# EAGLE schematic Sch (EAGLE 7.5.0)
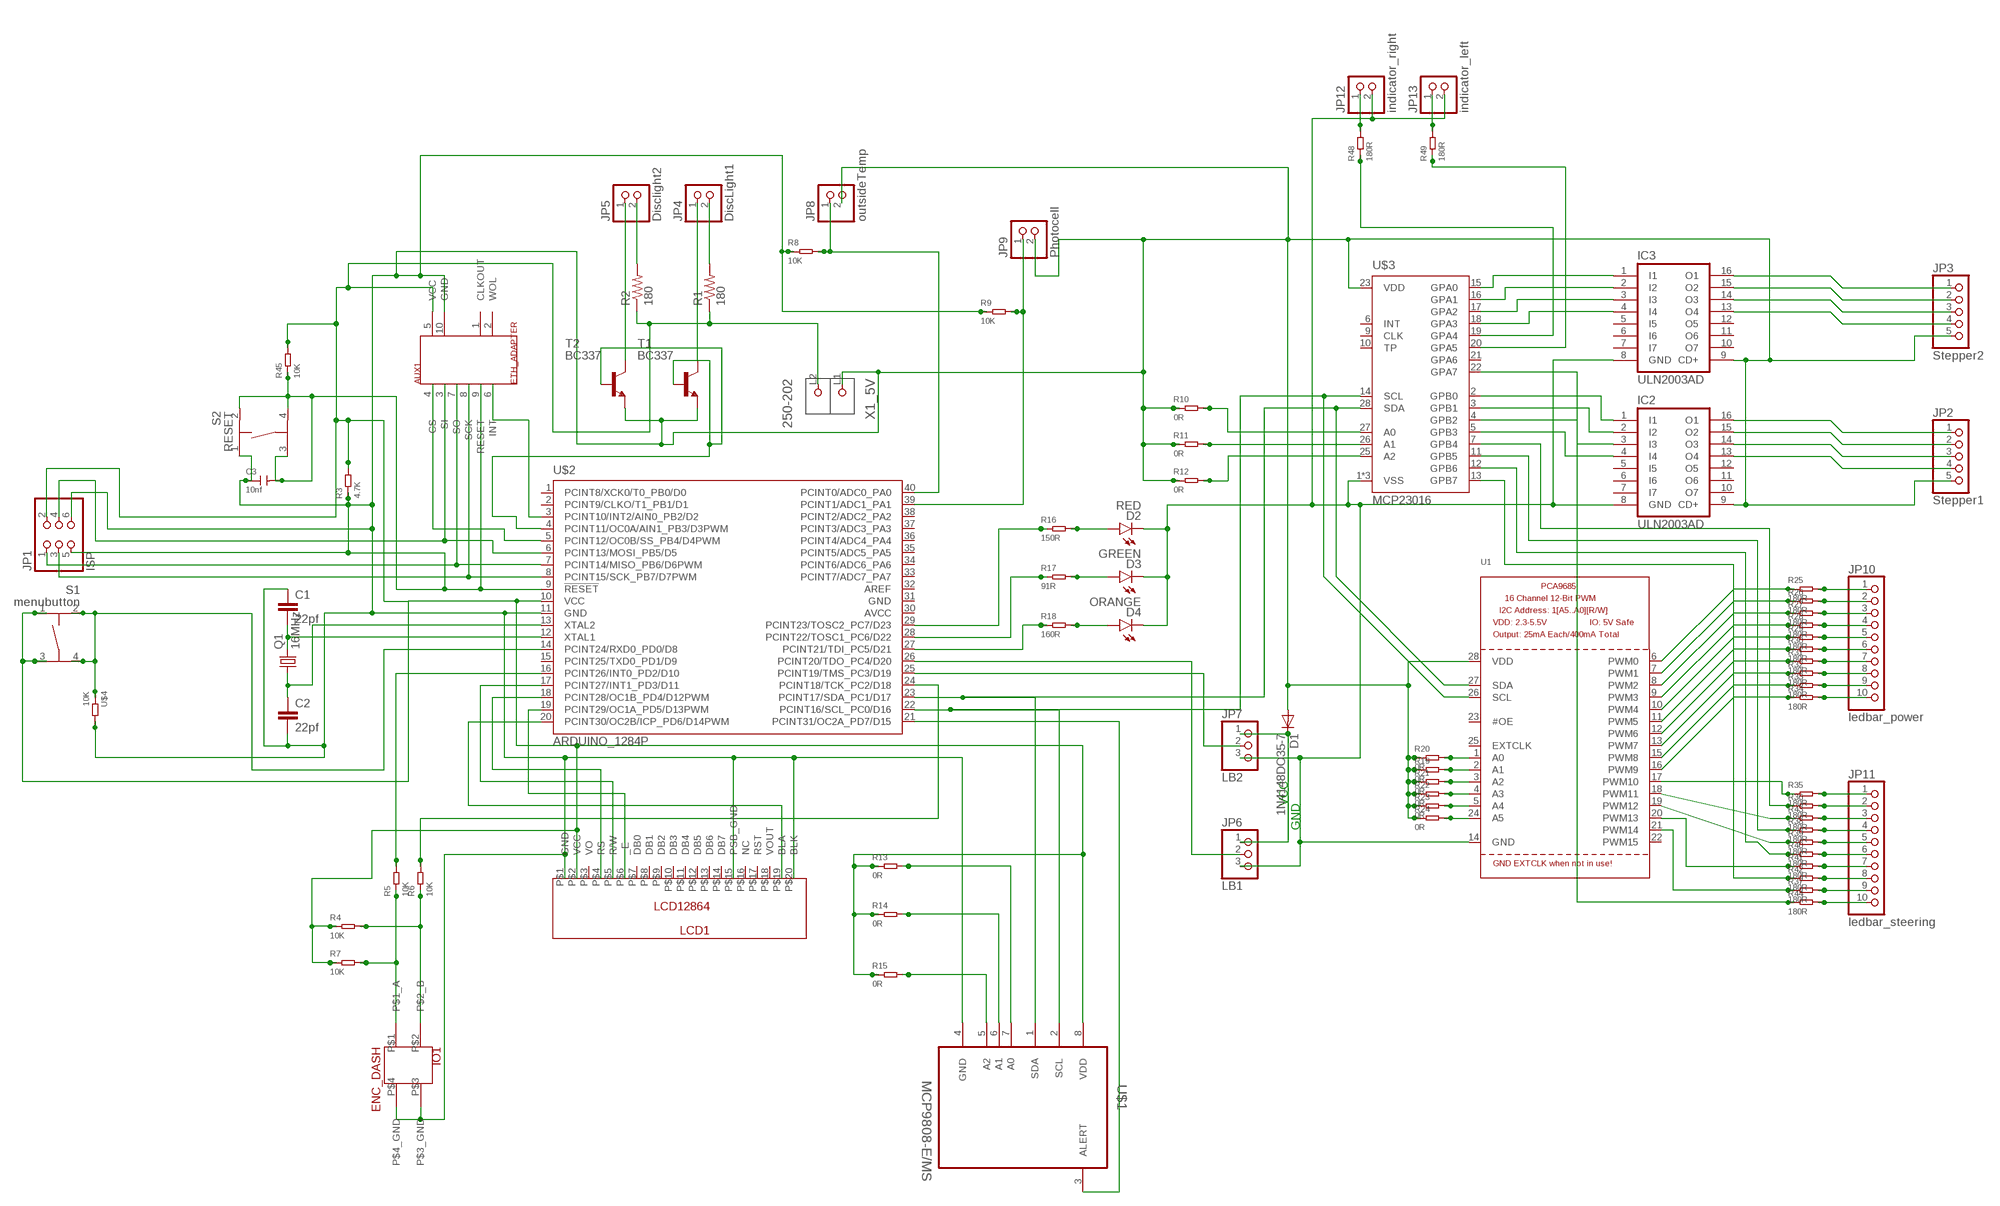
[diagram p0: schematic, sheet 1]

## Parts
AUX1  ETH_ADAPTER  [PINHEAD5X5]
C1  22pf  C-EU025-025X050  [C025-025X050]
C2  22pf  C-EU025-025X050  [C025-025X050]
C3  10nf  CERAMIC-10NF-50V-10%-X7R(0603)  [C0603]
D1  1N4148DO35-7  [DO35-7]
D2  RED  LED-RED0603  [LED-0603]
D3  GREEN  LED-RED0603  [LED-0603]
D4  ORANGE  LED-RED0603  [LED-0603]
IC2  ULN2003AD  [SO16]
IC3  ULN2003AD  [SO16]
IO1  ENC_DASH  [PINHEAD2X2]
JP1  ISP  PINHD-2X3  [2X03]
JP2  Stepper1  PINHD-1X5  [1X05]
JP3  Stepper2  PINHD-1X5  [1X05]
JP4  DiscLight1  PINHD-1X2  [1X02]
JP5  Disclight2  PINHD-1X2  [1X02]
JP6  LB1  PINHD-1X3  [1X03]
JP7  LB2  PINHD-1X3  [1X03]
JP8  outsideTemp  PINHD-1X2  [1X02]
JP9  Photocell  PINHD-1X2  [1X02]
JP10  ledbar_power  PINHD-1X10  [1X10]
JP11  ledbar_steering  PINHD-1X10  [1X10]
JP12  indicator_right  PINHD-1X2  [1X02]
JP13  indicator_left  PINHD-1X2  [1X02]
LCD1  LCD12864  [PINHEAD1X20]
Q1  16MHz  CRYSTALHC49S  [HC49/S]
R1  180  FLIPFLOP-RES  [0805-THM]
R2  180  FLIPFLOP-RES  [0805-THM]
R3  4.7K  SMD-RES-4.7K-5%-1/10W(0603)  [R0603]
R4  10K  SMD-RES-10K-1%-1/10W(0603)  [R0603]
R5  10K  SMD-RES-10K-1%-1/10W(0603)  [R0603]
R6  10K  SMD-RES-10K-1%-1/10W(0603)  [R0603]
R7  10K  SMD-RES-10K-1%-1/10W(0603)  [R0603]
R8  10K  SMD-RES-10K-1%-1/10W(0603)  [R0603]
R9  10K  SMD-RES-10K-1%-1/10W(0603)  [R0603]
R10  0R  SMD-RES-0R-5%-1/10W(0603)  [R0603]
R11  0R  SMD-RES-0R-5%-1/10W(0603)  [R0603]
R12  0R  SMD-RES-0R-5%-1/10W(0603)  [R0603]
R13  0R  SMD-RES-0R-5%-1/10W(0603)  [R0603]
R14  0R  SMD-RES-0R-5%-1/10W(0603)  [R0603]
R15  0R  SMD-RES-0R-5%-1/10W(0603)  [R0603]
R16  150R  SMD-RES-0R-5%-1/10W(0603)  [R0603]
R17  91R  SMD-RES-0R-5%-1/10W(0603)  [R0603]
R18  160R  SMD-RES-0R-5%-1/10W(0603)  [R0603]
R19  0R  SMD-RES-0R-5%-1/10W(0603)  [R0603]
R20  0R  SMD-RES-0R-5%-1/10W(0603)  [R0603]
R21  0R  SMD-RES-0R-5%-1/10W(0603)  [R0603]
R22  0R  SMD-RES-0R-5%-1/10W(0603)  [R0603]
R23  0R  SMD-RES-0R-5%-1/10W(0603)  [R0603]
R24  0R  SMD-RES-0R-5%-1/10W(0603)  [R0603]
R25  180R  SMD-RES-0R-5%-1/10W(0603)  [R0603]
R26  180R  SMD-RES-0R-5%-1/10W(0603)  [R0603]
R27  180R  SMD-RES-0R-5%-1/10W(0603)  [R0603]
R28  180R  SMD-RES-0R-5%-1/10W(0603)  [R0603]
R29  180R  SMD-RES-0R-5%-1/10W(0603)  [R0603]
R30  180R  SMD-RES-0R-5%-1/10W(0603)  [R0603]
R31  180R  SMD-RES-0R-5%-1/10W(0603)  [R0603]
R32  180R  SMD-RES-0R-5%-1/10W(0603)  [R0603]
R33  180R  SMD-RES-0R-5%-1/10W(0603)  [R0603]
R34  180R  SMD-RES-0R-5%-1/10W(0603)  [R0603]
R35  180R  SMD-RES-0R-5%-1/10W(0603)  [R0603]
R36  180R  SMD-RES-0R-5%-1/10W(0603)  [R0603]
R37  180R  SMD-RES-0R-5%-1/10W(0603)  [R0603]
R38  180R  SMD-RES-0R-5%-1/10W(0603)  [R0603]
R39  180R  SMD-RES-0R-5%-1/10W(0603)  [R0603]
R40  180R  SMD-RES-0R-5%-1/10W(0603)  [R0603]
R41  180R  SMD-RES-0R-5%-1/10W(0603)  [R0603]
R42  180R  SMD-RES-0R-5%-1/10W(0603)  [R0603]
R43  180R  SMD-RES-0R-5%-1/10W(0603)  [R0603]
R44  180R  SMD-RES-0R-5%-1/10W(0603)  [R0603]
R45  10K  SMD-RES-10K-1%-1/10W(0603)  [R0603]
R48  180R  SMD-RES-100R-5%-1/10W(0603)  [R0603]
R49  180R  SMD-RES-100R-5%-1/10W(0603)  [R0603]
S1  menubutton  TASTER-9314_SMD  [TASTER-9314_SMD]
S2  RESET  TASTER-9314_SMD  [TASTER-9314_SMD]
T1  BC337  [TO92]
T2  BC337  [TO92]
U1  PCA9685  [TSSOP28]
U$1  MCP9808-E/MS  [SOP65P490X110-8N]
U$2  ARDUINO_1284P  [DIL40]
U$3  MCP23016  [SO28W]
U$4  10K  SMD-RES-10K-1%-1/8W(0805)  [R0805]
X1_5V  250-202  [P-250-202]

## Nets
DISCLIGHT1: T1.2(B) T2.2(B) U$2.4(PCINT11/OC0A/AIN1_PB3/D3PWM)
GND: C1.1 C2.2 C3.1 D1.A IC2.9(CD+) IC3.9(CD+) JP1.6 JP2.5 JP3.5 JP8.2 JP9.2 LCD1.P$1(GND) LCD1.P$15(PSB_GND) LCD1.P$20(BLK) R3.1 R8.1 R9.1 R10.1 R11.1 R12.1 R19.1 R20.1 R21.1 R22.1 R23.1 R24.1 S2.1 T1.1(E) T2.1(E) U1.28(VDD) U$1.4(GND) U$2.11(GND) U$3.23(VDD) U$4.2 X1_5V.L1(P1)
N$1: IC2.16(O1) JP2.1
N$2: IC2.15(O2) JP2.2
N$3: IC2.14(O3) JP2.3
N$4: IC2.13(O4) JP2.4
N$5: IC3.16(O1) JP3.1
N$6: IC3.15(O2) JP3.2
N$7: IC3.14(O3) JP3.3
N$8: IC3.13(O4) JP3.4
N$9: JP1.2 LCD1.P$2(VCC) R1.1 R2.1 R3.2 R4.1 R7.1 R13.1 R14.1 R15.1 R45.2 S1.1 S1.3 U$1.8(VDD) U$2.10(VCC) X1_5V.L2(P2)
N$10: R36.1 U$3.7(GPB4)
N$11: JP5.1 T2.3(C)
N$12: JP5.2 R2.2
N$13: JP4.2 R1.2
N$14: JP4.1 T1.3(C)
N$15: S1.2 S1.4 U$2.14(PCINT24/RXD0_PD0/D8) U$4.1
N$16: IC3.1(I1) U$3.15(GPA0)
N$17: C2.1 Q1.1 U$2.13(XTAL2)
N$18: IC3.2(I2) U$3.16(GPA1)
N$19: C1.2 Q1.2 U$2.12(XTAL1)
N$20: IC3.3(I3) U$3.17(GPA2)
N$21: D1.C JP6.1 JP7.1
N$22: R11.2 U$3.26(A1)
N$23: AUX1.7(SO) JP1.1 U$2.7(PCINT14/MISO_PB6/D6PWM)
N$24: AUX1.8(SCK) JP1.3 U$2.8(PCINT15/SCK_PB7/D7PWM)
N$25: IC3.4(I4) U$3.18(GPA3)
N$26: AUX1.3(SI) JP1.4 U$2.6(PCINT13/MOSI_PB5/D5)
N$27: R38.1 U$3.11(GPB5)
N$28: U$1.3(ALERT) U$2.21(PCINT31/OC2A_PD7/D15)
N$29: R4.2 R6.1
N$30: AUX1.6(INT) U$2.3(PCINT10/INT2/AIN0_PB2/D2)
N$31: AUX1.4(CS) U$2.5(PCINT12/OC0B/SS_PB4/D4PWM)
N$32: U1.26(SCL) U$1.2(SCL) U$2.22(PCINT16/SCL_PC0/D16) U$3.14(SCL)
N$33: U1.27(SDA) U$1.1(SDA) U$2.23(PCINT17/SDA_PC1/D17) U$3.28(SDA)
N$34: R5.1 R7.2
N$35: IC2.1(I1) U$3.2(GPB0)
N$36: IC2.2(I2) U$3.3(GPB1)
N$37: LCD1.P$4(RS) U$2.18(PCINT28/OC1B_PD4/D12PWM)
N$38: LCD1.P$5(R/W) U$2.17(PCINT27/INT1_PD3/D11)
N$39: LCD1.P$6(_E) U$2.19(PCINT29/OC1A_PD5/D13PWM)
N$40: LCD1.P$19(BLA) U$2.20(PCINT30/OC2B/ICP_PD6/D14PWM)
N$41: R5.2 U$2.16(PCINT26/INT0_PD2/D10)
N$42: R6.2 U$2.24(PCINT18/TCK_PC2/D18)
N$43: IC2.3(I3) U$3.4(GPB2)
N$44: IC2.4(I4) U$3.5(GPB3)
N$45: R14.2 U$1.6(A1)
N$46: JP7.2 U$2.25(PCINT19/TMS_PC3/D19)
N$47: JP6.2 U$2.26(PCINT20/TDO_PC4/D20)
N$48: JP8.1 R8.2 U$2.40(PCINT0/ADC0_PA0)
N$49: R10.2 U$3.27(A0)
N$50: JP9.1 R9.2 U$2.39(PCINT1/ADC1_PA1)
N$51: R41.1 U1.20(PWM13)
N$52: R12.2 U$3.25(A2)
N$53: R13.2 U$1.7(A0)
N$54: R15.2 U$1.5(A2)
N$55: R39.1 U1.19(PWM12)
N$56: D2.A R16.2
N$57: D3.A R17.2
N$58: D4.A R18.2
N$59: R18.1 U$2.27(PCINT21/TDI_PC5/D21)
N$60: R17.1 U$2.28(PCINT22/TOSC1_PC6/D22)
N$61: R16.1 U$2.29(PCINT23/TOSC2_PC7/D23)
N$62: R24.2 U1.24(A5)
N$63: R23.2 U1.5(A4)
N$64: R22.2 U1.4(A3)
N$65: R21.2 U1.3(A2)
N$66: R19.2 U1.2(A1)
N$67: R20.2 U1.1(A0)
N$68: JP10.1 R25.2
N$69: JP10.2 R26.2
N$70: JP10.3 R27.2
N$71: JP10.4 R28.2
N$72: JP10.5 R29.2
N$73: JP10.6 R30.2
N$74: JP10.7 R31.2
N$75: JP10.8 R32.2
N$76: JP10.9 R33.2
N$77: JP10.10 R34.2
N$78: JP11.1 R35.2
N$79: JP11.2 R36.2
N$80: JP11.3 R43.2
N$81: JP11.4 R38.2
N$82: JP11.5 R39.2
N$83: JP11.6 R40.2
N$84: JP11.7 R41.2
N$85: JP11.8 R42.2
N$86: JP11.9 R37.2
N$87: JP11.10 R44.2
N$88: R25.1 U1.6(PWM0)
N$89: R26.1 U1.7(PWM1)
N$90: R27.1 U1.8(PWM2)
N$91: R28.1 U1.9(PWM3)
N$92: R29.1 U1.10(PWM4)
N$93: R30.1 U1.11(PWM5)
N$94: R31.1 U1.12(PWM6)
N$95: R32.1 U1.13(PWM7)
N$96: R33.1 U1.15(PWM8)
N$97: R34.1 U1.16(PWM9)
N$98: R35.1 U1.17(PWM10)
N$99: R43.1 U1.18(PWM11)
N$102: R37.1 U1.21(PWM14)
N$103: R40.1 U$3.12(GPB6)
N$105: AUX1.9(RESET) C3.2 JP1.5 R45.1 S2.2 S2.3 S2.4 U$2.9(!RESET)
N$106: R42.1 U$3.13(GPB7)
N$107: R44.1 U$3.22(GPA7)
N$108: R48.1 U$3.19(GPA4)
N$109: R49.1 U$3.20(GPA5)
N$110: JP12.1 R48.2
N$111: JP13.1 R49.2
N$112: D2.C D3.C D4.C IC2.8(GND) IC3.8(GND) JP6.3 JP7.3 JP12.2 JP13.2 U1.14(GND) U$3.1(VSS) U$3.8(VSS) U$3.24(VSS)
Unconnected: AUX1.1(CLKOUT) AUX1.2(WOL) AUX1.10(GND) IC2.5(I5) IC2.6(I6) IC2.7(I7) IC2.10(O7) IC2.11(O6) IC2.12(O5) IC3.5(I5) IC3.6(I6) IC3.7(I7) IC3.10(O7) IC3.11(O6) IC3.12(O5) IO1.P$1(P$1_A) IO1.P$2(P$2_B) IO1.P$3(P$3_GND) IO1.P$4(P$4_GND) LCD1.P$3(VO) LCD1.P$7(DB0) LCD1.P$8(DB1) LCD1.P$9(DB2) LCD1.P$10(DB3) LCD1.P$11(DB4) LCD1.P$12(DB5) LCD1.P$13(DB6) LCD1.P$14(DB7) LCD1.P$16(NC) LCD1.P$17(RST) LCD1.P$18(VOUT) U1.22(PWM15) U1.23(#OE) U1.25(EXTCLK) U$2.1(PCINT8/XCK0/T0_PB0/D0) U$2.2(PCINT9/CLKO/T1_PB1/D1) U$2.15(PCINT25/TXD0_PD1/D9) U$2.32(AREF) U$2.33(PCINT7/ADC7_PA7) U$2.34(PCINT6/ADC6_PA6) U$2.35(PCINT5/ADC5_PA5) U$2.36(PCINT4/ADC4_PA4) U$2.37(PCINT3/ADC3_PA3) U$2.38(PCINT2/ADC2_PA2) U$3.6(INT) U$3.9(CLK) U$3.10(TP) U$3.21(GPA6)

## Notes on the sheet
- VCC
- GND

## Power pins joined to a net without a drawn wire
AVCC: U$2.30(AVCC)
GND: U$2.31(GND)
VCC: AUX1.5(VCC)

## Library data of the parts
AUX1 = Btz:ETH_ADAPTER
C1 C2 = rcl:C-EU: CAPACITOR, European symbol
C3 = Seeed-Capacitor-2016:CERAMIC-10NF-50V-10%-X7R(0603): 302010140; MPN: CC0603KRX7R9BB103
D1 = diode:1N4148: DIODE high speed (Philips)
D2 = SparkFun-LED:LED-RED: Assorted Red LEDs LilyPad 1206- DIO-09912 1206- DIO-00809 0603- DIO-00819 "SMART" means more efficient and expensive; PROD_ID: DIO-00819
D3 D4 = SparkFun-LED:LED-RED: Assorted Red LEDs LilyPad 1206- DIO-09912 1206- DIO-00809 0603- DIO-00819 "SMART" means more efficient and expensive; PROD_ID: DIO-00819; VALUE: RED
IC2 IC3 = uln-udn:ULN2003A: DRIVER ARRAY
IO1 = Btz:ENC_DASH
JP1 = pinhead:PINHD-2X3: PIN HEADER
JP2 JP3 = pinhead:PINHD-1X5: PIN HEADER
JP4 JP5 JP8 JP9 JP12 JP13 = pinhead:PINHD-1X2: PIN HEADER
JP6 JP7 = pinhead:PINHD-1X3: PIN HEADER
JP10 JP11 = pinhead:PINHD-1X10: PIN HEADER
LCD1 = Btz:LCD12864
Q1 = crystal:CRYSTAL: CRYSTAL; OC_FARNELL: 1667008; OC_NEWARK: unknown
R1 R2 = adafruit:FLIPFLOP-RES: Flip Flop resistor An 0805 resistor inside a standard 1/4W 5% resistor. Makes for easy mods
R3 = Seeed-Resistor-2016:SMD-RES-4.7K-5%-1/10W(0603): 301010290; MPN: RC0603JR-074K7L
R4-R9 R45 = Seeed-Resistor-2016:SMD-RES-10K-1%-1/10W(0603): 301010299; MPN: RC0603FR-0710KL
R10-R15 R19-R24 = Seeed-Resistor-2016:SMD-RES-0R-5%-1/10W(0603): 301010292; MPN: RC0603JR-070RL
R16-R18 R25-R44 = Seeed-Resistor-2016:SMD-RES-0R-5%-1/10W(0603): 301010292; MPN: RC0603JR-070RL; VALUE: 0R
R48 R49 = Seeed-Resistor-2016:SMD-RES-100R-5%-1/10W(0603): 301010090; MPN: RC0603JR-07100RL; VALUE: 100R
S1 S2 = Ergaenzung:TASTER-9314_SMD
T1 T2 = transistor:BC337: NPN TRANSISTOR
U1 = adafruit:PCA9685: PCA9685 - 16 Channel 12-Bit I2C PWM Controller 5.0V tolerant 16 channel, 12-bit I2C PWM controller with 25mA per output (max. 400mA total) Digikey: 568-5931-1-ND
U$1 = mcp9808:MCP9808-E/MS: Digital Temperature Sensor,MSOP-8; MPN: MCP9808-E/MS; OC_FARNELL: 2080523; OC_NEWARK: 89T8871; PACKAGE: MSOP-8; SUPPLIER: MICROCHIP
U$2 = Btz:ARDUINO_1284P
U$3 = Btz:MCP23016
U$4 = Seeed-Resistor-2016:SMD-RES-10K-1%-1/8W(0805): 301010361; MPN: RC0805FR-0710KL
X1_5V = con-wago_250:250-202: Serie 250, 1-Leiter-Klemmenleiste für Leiterplatten 1 Lötstift/Pol versetzt / Series 250, 1-conductor PCB terminal strip 1 solder pin/pole, staggered Polzahl / Pole No.: 2 Rastermaß / Pitch: 3.5 - 3.5 mm Bemessungsspannung / Rated Voltage: 320 V Nennstrom / Nominal Current: 8 A Leiterquerschnitt / Conductor Size: 0.2 - 1.5 mm2 Anschlusstechnik / Connection Technology: CAGE CLAMP® S Lötstiftlänge: / Solder Pin Length: 3.6 mm Leitereinführung (zur Platine) / Conductor entry angle (to PCB): 45 ° Farbe / Color: grau / gray Stand: 01.01.2014. Die jeweils aktuellen Daten zu diesem Artikel finden Sie in unserem Produktkatalog, den Sie unter www.wago.com einsehen können. As of: 01/01/2014. Please find the newest data for this article in our product catalogue, which can be viewed under www.wago.com.